# EAGLE design Node (EAGLE 7.7.0)
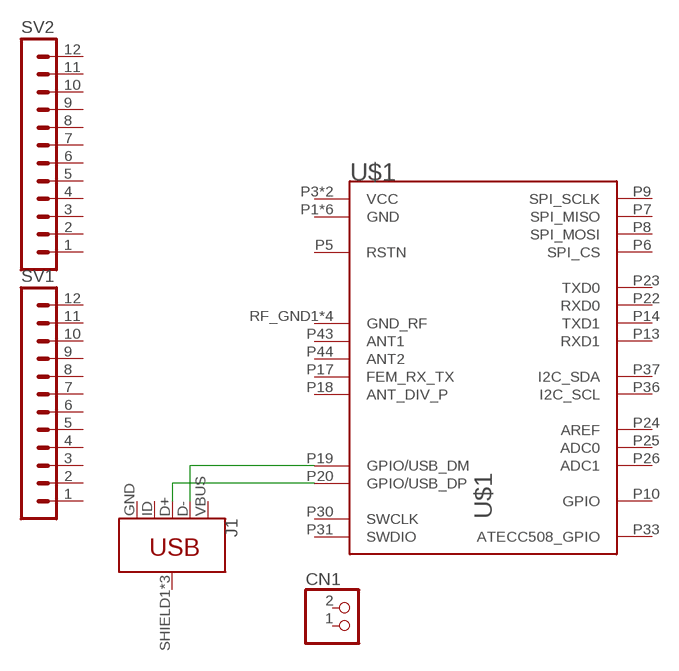
[diagram p0: schematic, sheet 1]

## Parts
CN1  JST_2PIN-THM-RA  [JST-PH-2-THM-RA]
J1  USB_MICRO-B_FEMALE-SMT  [USB-B-MICRO-SMD]
SV1  MA12-1  [MA12-1]
SV2  MA12-1  [MA12-1]
U$1  ATSAMR21G18-MR210UA  [ATSAMR21G18A-MR210UA]

## Nets
N$1: J1.D- U$1.P19(GPIO/USB_DM)
N$2: J1.D+ U$1.P20(GPIO/USB_DP)
Unconnected: CN1.1 CN1.2 J1.ID J1.SHIELD1(SHIELD) J1.SHIELD2(SHIELD) J1.SHIELD3(SHIELD) SV1.1 SV1.2 SV1.3 SV1.4 SV1.5 SV1.6 SV1.7 SV1.8 SV1.9 SV1.10 SV1.11 SV1.12 SV2.1 SV2.2 SV2.3 SV2.4 SV2.5 SV2.6 SV2.7 SV2.8 SV2.9 SV2.10 SV2.11 SV2.12 U$1.P5(RSTN) U$1.P6(SPI_CS) U$1.P7(SPI_MISO) U$1.P8(SPI_MOSI) U$1.P9(SPI_SCLK) U$1.P10(GPIO) U$1.P13(RXD1) U$1.P14(TXD1) U$1.P17(FEM_RX_TX) U$1.P18(ANT_DIV_P) U$1.P22(RXD0) U$1.P23(TXD0) U$1.P25(ADC0) U$1.P26(ADC1) U$1.P30(SWCLK) U$1.P31(SWDIO) U$1.P33(ATECC508_GPIO) U$1.P36(I2C_SCL) U$1.P37(I2C_SDA) U$1.P43(ANT1) U$1.P44(ANT2) U$1.RF_GND1(GND_RF) U$1.RF_GND2(GND_RF) U$1.RF_GND3(GND_RF) U$1.RF_GND4(GND_RF)

## Power pins joined to a net without a drawn wire
AREF: U$1.P24(AREF)
GND: J1.GND U$1.P1(GND) U$1.P2(GND) U$1.P12(GND) U$1.P29(GND) U$1.P41(GND) U$1.P42(GND)
VBUS: J1.VBUS
VCC: U$1.P3(VCC) U$1.P4(VCC)

## Library data of the parts
CN1 = adafruit:JST_2PIN: JST 2-Pin Connectors of various flavors SMT-RA (S2B-PH-SM4) 4UConnector #17311 SMT (B2B-PH-SM4) THM-RA (S2B-PH) THM (B2B-PH)
J1 = SparkFun-Connectors:USB_MICRO-B: USB Type Micro-B Connector Male/female and PTH/SMT variants SparkFun Products: SparkFun microB USB Breakout <https://www.sparkfun.com/products/12035> SparkFun USB microB Plug Breakout <https://www.sparkfun.com/products/10031> SparkFun ESP8266 Thing <https://www.sparkfun.com/products/13231>; PROD_ID: CONN-11752
SV1 SV2 = con-lstb:MA12-1: PIN HEADER; OC_FARNELL: unknown; OC_NEWARK: unknown
U$1 = radios:ATSAMR21G18-MR210UA

## Board
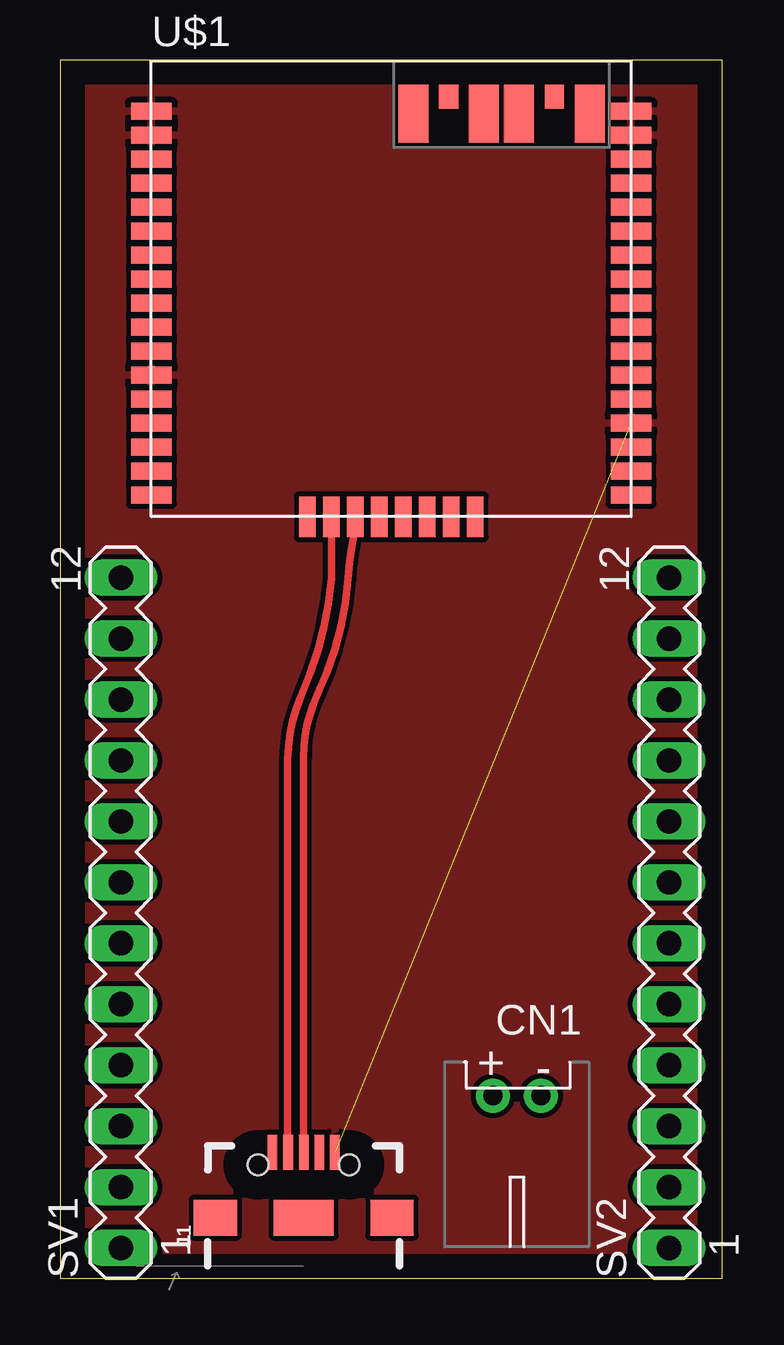
[diagram p1: board, top side]

Size 27.61 x 50.79 mm. Coordinates in mm from the lower left corner, seen from the top.
Outline: 0,0 27.61,0 27.61,50.79 0,50.79 0,0
Copper layers (1*16): Top 0.035mm / dielectric 1.5mm / Bottom 0.035mm
Design rules "default": minimum track width 10mil, minimum drill 24mil, track to track 8mil, track to pad 8mil, pad to pad 8mil, via to via 8mil, smd to smd 8mil, copper to edge 40mil, drill to drill 8mil, minimum pad ring 10mil, minimum via ring 8mil, stop-mask expansion 4mil, vias tented up to drill 0mil, thermal gap 10mil

### Footprints (pad centres in the part's own frame; a part is rotated, then mirrored left to right if it is on the bottom)
JST-PH-2-THM-RA = drill 0.8 pad 1.422: 1 1,0; 2 -1,0
USB-B-MICRO-SMD = smd 1.45 x 0.4: D+ 2.725,0; D- 2.725,0.65; GND 2.725,-1.3; ID 2.725,-0.65; VBUS 2.725,1.3 | smd 1.5 x 1.8: SHIELD1 0,3.685; SHIELD2 0,-3.685 | smd 1.5 x 2.5: SHIELD3 0,0 | hole 0.85: 2.2,1.9; 2.2,-1.9
MA12-1 = drill 1.016 long: 1 -13.97,0; 2 -11.43,0; 3 -8.89,0; 4 -6.35,0; 5 -3.81,0; 6 -1.27,0; 7 1.27,0; 8 3.81,0; 9 6.35,0; 10 8.89,0; 11 11.43,0; 12 13.97,0
ATSAMR21G18A-MR210UA = smd 1.7 x 0.7: P1 0,16.9; P2 0,15.9; P3 0,14.9; P4 0,13.9; P5 0,12.9; P6 0,11.9; P7 0,10.9; P8 0,9.9; P9 0,8.9; P10 0,7.9; P11 0,6.9; P12 0,5.9; P13 0,4.9; P14 0,3.9; P15 0,2.9; P16 0,1.9; P17 0,0.9; P26 20,0.9; P27 20,1.9; P28 20,2.9; P29 20,3.9; P30 20,4.9; P31 20,5.9; P32 20,6.9; P33 20,7.9; P34 20,8.9; P35 20,9.9; P36 20,10.9; P37 20,11.9; P38 20,12.9; P39 20,13.9; P40 20,14.9; P41 20,15.9; P42 20,16.9 | smd 0.7 x 1.7: P18 6.5,0; P19 7.5,0; P20 8.5,0; P21 9.5,0; P22 10.5,0; P23 11.5,0; P24 12.5,0; P25 13.5,0 | smd 0.8 x 1: P43 16.8,17.5; P44 12.4,17.5 | smd 1.25 x 2.4: RF_GND1 18.275,16.8; RF_GND2 15.325,16.8; RF_GND3 13.875,16.8; RF_GND4 10.925,16.8

### Placement (x,y rotation side)
CN1  19.05,7.62 180 top
J1  10.16,2.54 90 top
SV1  2.54,15.24 90 top
SV2  25.4,15.24 90 top
U$1  3.81,31.75 0 top

### Tracks (layer width: path | path; a pad name or v marks a point on that pad's centre or on a via)
GND  (1 unrouted)
  pour Top: 0,0 0,50.8 27.61,50.8 27.61,0
N$1
  Top 0.305: J1.D- 9.5,21.61 arc-24 10.06,24.28 arc18 11.33,29.18 11.33,31.73 arc90 U$1.P19
N$2
  Top 0.305: J1.D+ 10.16,21.74 arc-25 10.74,24.36 arc21 12.01,29.18 arc-8 12.31,31.22 | 12.31,31.03 12.31,31.22 | 12.31,31.22 U$1.P20
VCC  (1 unrouted)